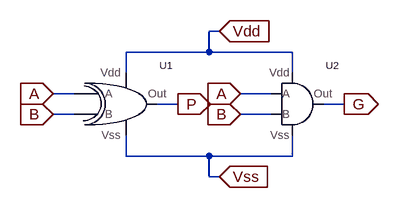
[diagram p0: schematic PG_Generator.asc]
PG_Generator.asc, the LTspice schematic file:
Version 4
SHEET 1 880 680
WIRE 208 -112 192 -112
WIRE 192 -80 192 -112
WIRE 192 -80 64 -80
WIRE 320 -80 192 -80
WIRE 64 -48 64 -80
WIRE 320 -48 320 -80
WIRE -16 -16 -48 -16
WIRE 288 -16 240 -16
WIRE 144 0 112 0
WIRE 400 0 368 0
WIRE -16 16 -48 16
WIRE 288 16 240 16
WIRE 64 80 64 48
WIRE 192 80 64 80
WIRE 320 80 320 48
WIRE 320 80 192 80
WIRE 192 112 192 80
WIRE 208 112 192 112
FLAG -48 -16 A
IOPIN -48 -16 In
FLAG 240 -16 A
IOPIN 240 -16 In
FLAG -48 16 B
IOPIN -48 16 In
FLAG 240 16 B
IOPIN 240 16 In
FLAG 144 0 P
IOPIN 144 0 Out
FLAG 400 0 G
IOPIN 400 0 Out
FLAG 208 -112 Vdd
IOPIN 208 -112 In
FLAG 208 112 Vss
IOPIN 208 112 In
SYMBOL XOR1 0 0 R0
SYMATTR InstName U1
SYMBOL AND1 304 0 R0
SYMATTR InstName U2

The netlist it stands for:
* PG_Generator.asc
XU1 Vdd Vss P A B XOR1  ; pins Vdd Vss Out A B
XU2 Vdd Vss A B G AND1  ; pins Vdd Vss A B Out
.lib XOR1.sub
.lib AND1.sub
.backanno
.end